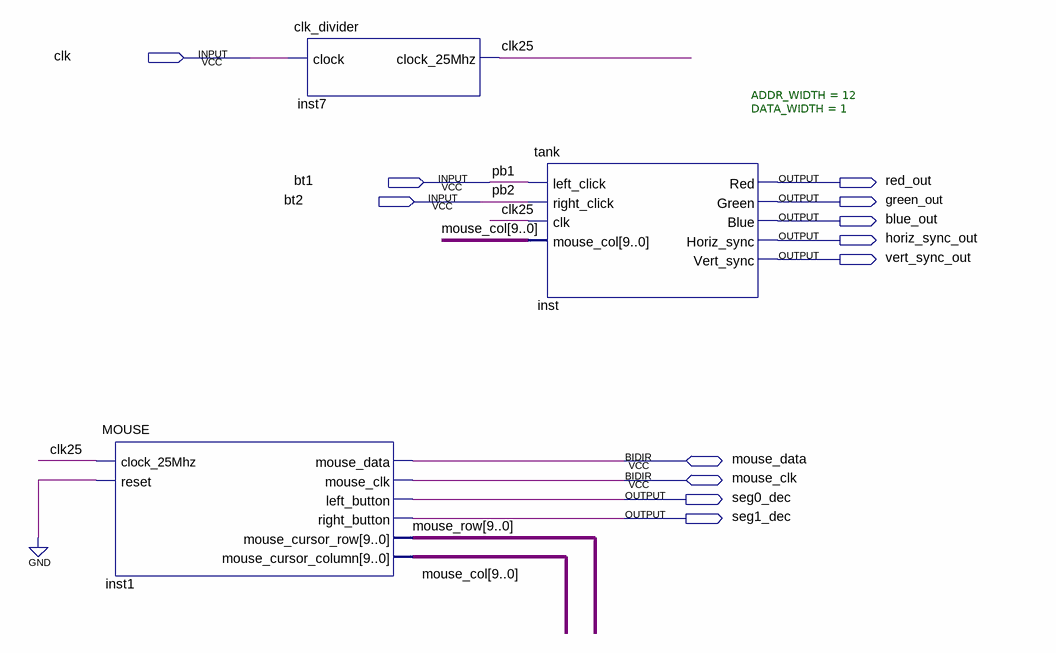
[diagram p0: schematic sheet]
// Quartus schematic mini_project_group09.bdf as structural Verilog: 3 symbols, 12 pins
module mini_project_group09 (
  input  clk,
  input  bt1,
  input  bt2,
  inout  mouse_data,
  inout  mouse_clk,
  output red_out,
  output green_out,
  output blue_out,
  output horiz_sync_out,
  output vert_sync_out,
  output seg0_dec,
  output seg1_dec
);

  wire clk25;
  wire [9:0] mouse_col, mouse_row;

  MOUSE inst1 (
    .clock_25Mhz(clk25), .reset(1'b0), .left_button(seg0_dec), .right_button(seg1_dec),
    .mouse_cursor_row(mouse_row), .mouse_cursor_column(mouse_col), .mouse_data(mouse_data),
    .mouse_clk(mouse_clk));
  clk_divider inst7 (.clock(clk), .clock_25Mhz(clk25));
  tank #(.ADDR_WIDTH(12), .DATA_WIDTH(1)) inst (
    .left_click(bt1), .right_click(bt2), .clk(clk25), .mouse_col(mouse_col), .Red(red_out),
    .Green(green_out), .Blue(blue_out), .Horiz_sync(horiz_sync_out), .Vert_sync(vert_sync_out));

  // Other names for the same wires on the sheet: pb1 = bt1; pb2 = bt2
endmodule
